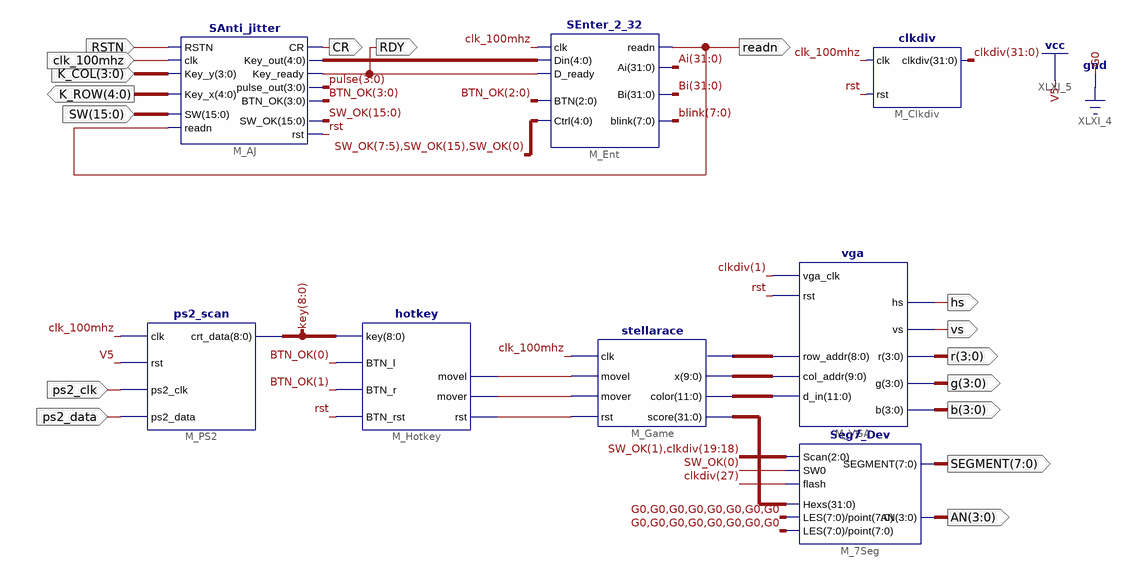
[diagram p0: schematic sheet 1]
// Xilinx ISE schematic Top.sch (kintex7) as structural Verilog: 8 symbols, 17 ports
module Top (
  input  clk_100mhz,
  input  [15:0] SW,
  input  [3:0] K_COL,
  input  RSTN,
  input  ps2_clk,
  input  ps2_data,
  output [4:0] K_ROW,
  output readn,
  output RDY,
  output CR,
  output hs,
  output vs,
  output [3:0] b,
  output [3:0] g,
  output [3:0] r,
  output [3:0] AN,
  output [7:0] SEGMENT
);

  wire rst, XLXN_60, XLXN_61, XLXN_62;
  wire [3:0] BTN_OK, pulse;
  wire [4:0] XLXN_24;
  wire [7:0] blink;
  wire [8:0] key, XLXN_28;
  wire [9:0] XLXN_32;
  wire [11:0] XLXN_33;
  wire [15:0] SW_OK;
  wire [31:0] Ai, Bi, clkdiv, score;

  SAnti_jitter M_AJ (
    .SW(SW), .readn(readn), .Key_y(K_COL), .Key_x(K_ROW), .RSTN(RSTN), .clk(clk_100mhz), .Key_out(XLXN_24),
    .Key_ready(RDY), .CR(CR), .rst(rst), .SW_OK(SW_OK), .pulse_out(pulse), .BTN_OK(BTN_OK));
  SEnter_2_32 M_Ent (
    .readn(readn), .Ai(Ai), .Bi(Bi), .blink(blink), .Din(XLXN_24), .D_ready(RDY), .clk(clk_100mhz),
    .Ctrl({SW_OK[7:5], SW_OK[15], SW_OK[0]}), .BTN(BTN_OK[2:0]));
  clkdiv M_Clkdiv (.rst(rst), .clkdiv(clkdiv), .clk(clk_100mhz));
  Seg7_Dev M_7Seg (
    .LES({8{1'b0}}), .Scan({SW_OK[1], clkdiv[19:18]}), .SEGMENT(SEGMENT), .AN(AN), .point({8{1'b0}}),
    .flash(clkdiv[27]), .SW0(SW_OK[0]), .Hexs(score));
  stellarace M_Game (
    .rst(XLXN_62), .movel(XLXN_60), .mover(XLXN_61), .x(XLXN_32), .score(score), .color(XLXN_33),
    .clk(clk_100mhz), .y(XLXN_28));
  hotkey M_Hotkey (
    .BTN_l(BTN_OK[0]), .BTN_r(BTN_OK[1]), .BTN_rst(rst), .key(key), .movel(XLXN_60), .mover(XLXN_61),
    .rst(XLXN_62));
  ps2_scan M_PS2 (.clk(clk_100mhz), .rst(1'b1), .ps2_clk(ps2_clk), .ps2_data(ps2_data), .crt_data(key));
  vga M_VGA (
    .vga_clk(clkdiv[1]), .hs(hs), .vs(vs), .row_addr(XLXN_28), .r(r), .g(g), .b(b), .col_addr(XLXN_32),
    .d_in(XLXN_33), .rst(rst));
endmodule
